# EAGLE design usbisp (EAGLE 5.02)
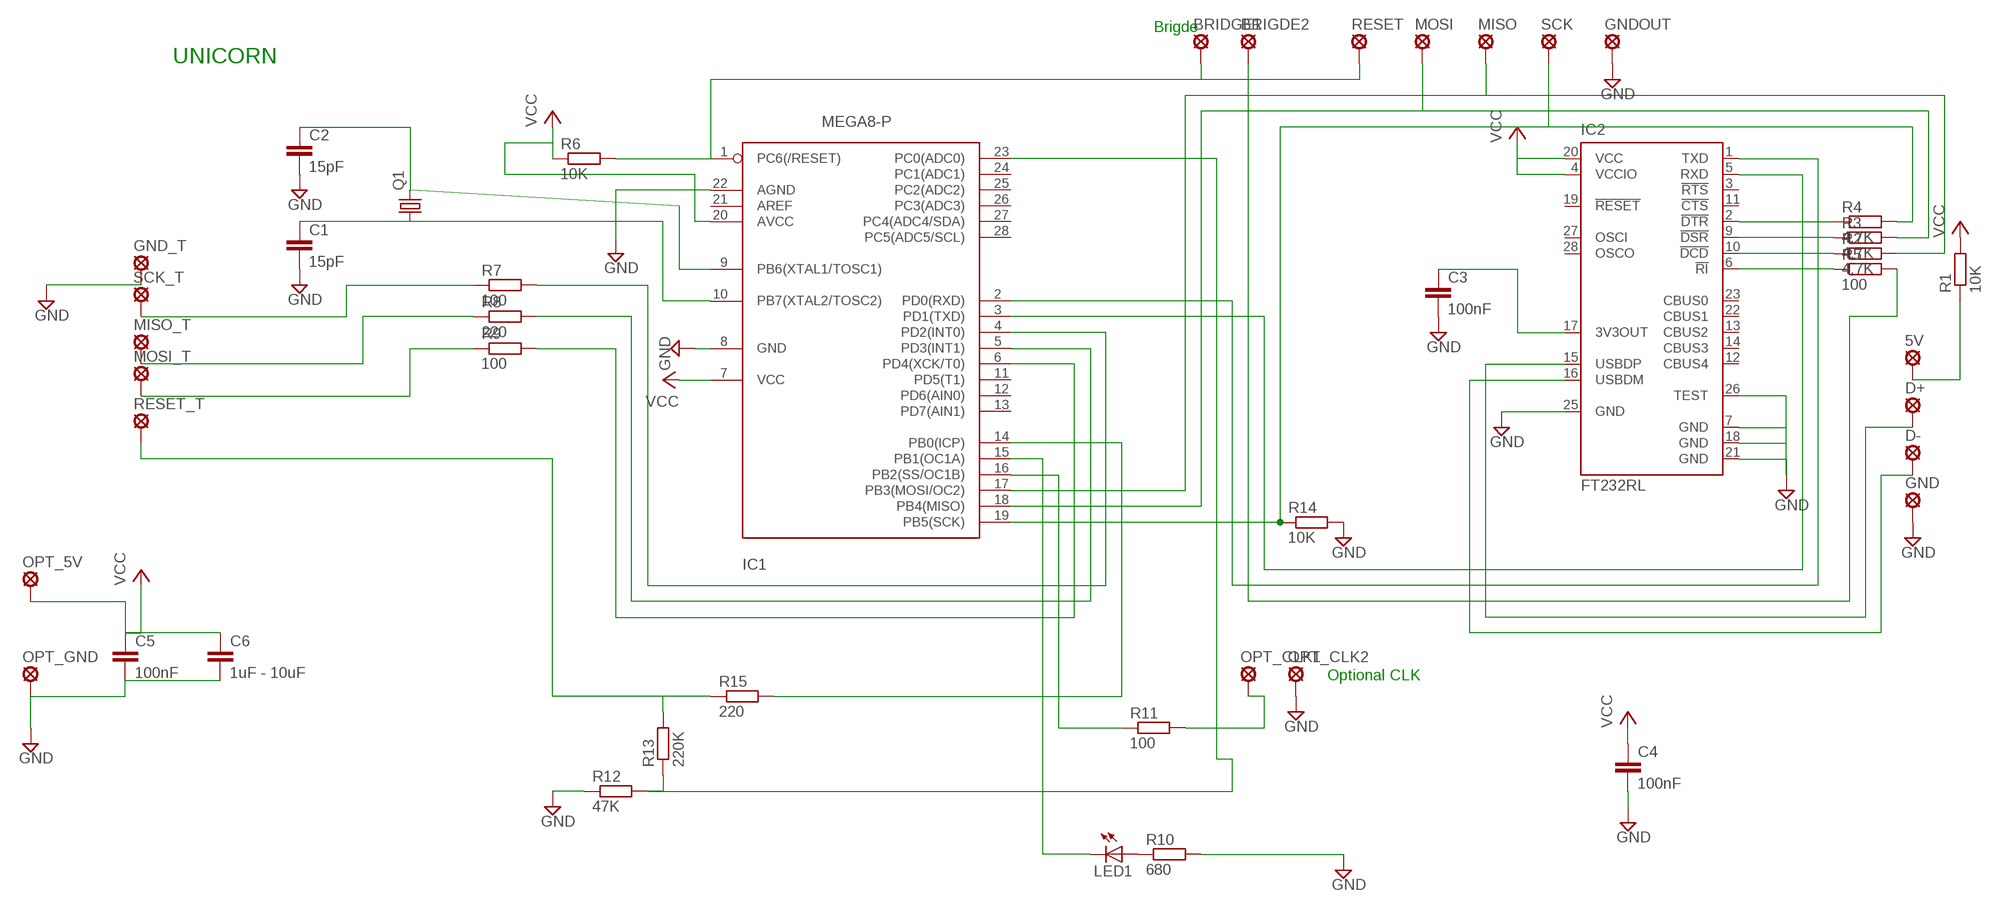
[diagram p0: schematic, sheet 1]

## Parts
5V  LSP10  [LSP10]
BRIDGE1  LSP10  [LSP10]
BRIGDE2  LSP10  [LSP10]
C1  15pF  C-EU075-032X103  [C075-032X103]
C2  15pF  C-EU075-032X103  [C075-032X103]
C3  100nF  C-EU102-043X133  [C102-043X133]
C4  100nF  C-EU102-043X133  [C102-043X133]
C5  100nF  C-EU075-032X103  [C075-032X103]
C6  1uF - 10uF  C-EU075-032X103  [C075-032X103]
D+  LSP10  [LSP10]
D-  LSP10  [LSP10]
GND  LSP10  [LSP10]
GND_T  LSP10  [LSP10]
GNDOUT  LSP10  [LSP10]
IC1  MEGA8-P  [DIL28-3]
IC2  FT232RL  [SSOP28]
LED1  LED5MM  [LED5MM]
MISO  LSP10  [LSP10]
MISO_T  LSP10  [LSP10]
MOSI  LSP10  [LSP10]
MOSI_T  LSP10  [LSP10]
OPT_5V  LSP13  [LSP13]
OPT_CLK1  LSP10  [LSP10]
OPT_CLK2  LSP10  [LSP10]
OPT_GND  LSP13  [LSP13]
Q1  CRYSTALHC49S  [HC49/S]
R1  10K  R-EU_0207/15  [0207/15]
R2  4,7K  R-EU_0207/15  [0207/15]
R3  4,7K  R-EU_0207/15  [0207/15]
R4  4,7K  R-EU_0207/15  [0207/15]
R5  100  R-EU_0207/15  [0207/15]
R6  10K  R-EU_0207/15  [0207/15]
R7  100  R-EU_0207/15  [0207/15]
R8  220  R-EU_0207/15  [0207/15]
R9  100  R-EU_0207/15  [0207/15]
R10  680  R-EU_0207/15  [0207/15]
R11  100  R-EU_0207/15  [0207/15]
R12  47K  R-EU_0207/15  [0207/15]
R13  220K  R-EU_0207/15  [0207/15]
R14  10K  R-EU_0207/15  [0207/15]
R15  220  R-EU_0207/15  [0207/15]
RESET  LSP10  [LSP10]
RESET_T  LSP10  [LSP10]
SCK  LSP10  [LSP10]
SCK_T  LSP10  [LSP10]

## Nets
GND: C1.2 C2.2 C3.2 C4.2 C5.2 C6.2 GND.MP GND_T.MP GNDOUT.MP IC1.8(GND) IC1.22(AGND) IC2.7(GND) IC2.18(GND) IC2.21(GND) IC2.25(GND) IC2.26(TEST) OPT_CLK2.MP OPT_GND.MP R10.2 R12.1 R14.2
N$1: 5V.MP R1.1
N$2: D-.MP IC2.16(USBDM)
N$3: D+.MP IC2.15(USBDP)
N$4: IC1.18(PB4(MISO)) MOSI.MP R3.2
N$5: IC1.17(PB3(MOSI/OC2)) MISO.MP R2.2
N$6: IC2.10(!DCD) R2.1
N$7: IC2.9(!DSR) R3.1
N$8: IC2.2(!DTR) R4.1
N$9: IC1.19(PB5(SCK)) R4.2 R14.1 SCK.MP
N$10: IC1.2(PD0(RXD)) IC2.1(TXD)
N$11: IC2.6(!RI) R5.1
N$12: BRIGDE2.MP R5.2
N$13: IC1.3(PD1(TXD)) IC2.5(RXD)
N$14: BRIDGE1.MP IC1.1(PC6(/RESET)) R6.2 RESET.MP
N$15: IC1.14(PB0(ICP)) R15.2
N$16: R7.1 SCK_T.MP
N$17: IC1.4(PD2(INT0)) R7.2
N$18: IC1.5(PD3(INT1)) R8.2
N$19: MISO_T.MP R8.1
N$20: MOSI_T.MP R9.1
N$21: IC1.6(PD4(XCK/T0)) R9.2
N$22: R13.2 R15.1 RESET_T.MP
N$23: IC1.23(PC0(ADC0)) R12.2 R13.1
N$24: C2.1 IC1.9(PB6(XTAL1/TOSC1)) Q1.2
N$25: C1.1 IC1.10(PB7(XTAL2/TOSC2)) Q1.1
N$26: IC1.16(PB2(SS/OC1B)) R11.1
N$27: OPT_CLK1.MP R11.2
N$28: LED1.A R10.1
N$29: IC1.15(PB1(OC1A)) LED1.K(C)
N$30: C3.1 IC2.17(3V3OUT)
VCC: C4.1 C5.1 C6.1 IC1.7(VCC) IC1.20(AVCC) IC2.4(VCCIO) IC2.20(VCC) OPT_5V.MP R1.2 R6.1
Unconnected: IC1.11(PD5(T1)) IC1.12(PD6(AIN0)) IC1.13(PD7(AIN1)) IC1.21(AREF) IC1.24(PC1(ADC1)) IC1.25(PC2(ADC2)) IC1.26(PC3(ADC3)) IC1.27(PC4(ADC4/SDA)) IC1.28(PC5(ADC5/SCL)) IC2.3(!RTS) IC2.11(!CTS) IC2.12(CBUS4) IC2.13(CBUS2) IC2.14(CBUS3) IC2.19(!RESET) IC2.22(CBUS1) IC2.23(CBUS0) IC2.27(OSCI) IC2.28(OSCO)

## Notes on the sheet
- Brigde
- UNICORN
- Optional CLK

## Library data of the parts
5V BRIDGE1 BRIGDE2 D+ D- GND GND_T GNDOUT MISO MISO_T MOSI MOSI_T OPT_CLK1 OPT_CLK2 RESET RESET_T SCK SCK_T = solpad:LSP10: SOLDER PAD drill 1.0 mm, distributor Buerklin, 12H555
C1-C6 = rcl:C-EU: CAPACITOR, European symbol
IC1 = atmel:MEGA8-P: MICROCONTROLLER 8 Kbytes FLASH, 1 kbytes SRAM, 512 bytes EEPROM, USART, 4-channel 10 bit ADC, 2-channel 8 bit ADC Pin compatible with Atmega48, ATMega88, ATMega168 Source: avr.lbr
IC2 = ftdichip:FT232R: Source: http://www.ftdichip.com/Documents/DataSheets/DS_FT232R_v104.pdf
LED1 = led:LED: LED OSRAM: - CHIPLED LG R971, LG N971, LY N971, LG Q971, LY Q971, LO R971, LY R971 LH N974, LH R974 LS Q976, LO Q976, LY Q976 LO Q996 - Hyper CHIPLED LW Q18S LB Q993, LB Q99A, LB R99A - SideLED LS A670, LO A670, LY A670, LG A670, LP A670 LB A673, LV A673, LT A673, LW A673 LH A674 LY A675 LS A676, LA A676, LO A676, LY A676, LW A676 LS A679, LY A679, LG A679 - Hyper Micro SIDELED® LS Y876, LA Y876, LO Y876, LY Y876 LT Y87S - SmartLED LW L88C, LW L88S LB L89C, LB L89S, LG L890 LS L89K, LO L89K, LY L89K LS L896, LA L896, LO L896, LY L896 - TOPLED LS T670, LO T670, LY T670, LG T670, LP T670 LSG T670, LSP T670, LSY T670, LOP T670, LYG T670 LG T671, LOG T671, LSG T671 LB T673, LV T673, LT T673, LW T673 LH T674 LS T676, LA T676, LO T676, LY T676, LB T676, LH T676, LSB T676, LW T676 LB T67C, LV T67C, LT T67C, LS T67K, LO T67K, LY T67K, LW E67C LS E67B, LA E67B, LO E67B, LY E67B, LB E67C, LV E67C, LT E67C LW T67C LS T679, LY T679, LG T679 LS T770, LO T770, LY T770, LG T770, LP T770 LB T773, LV T773, LT T773, LW T773 LH T774 LS E675, LA E675, LY E675, LS T675 LS T776, LA T776, LO T776, LY T776, LB T776 LHGB T686 LT T68C, LB T68C - Hyper Mini TOPLED® LB M676 - Mini TOPLED Santana® LG M470 LS M47K, LO M47K, LY M47K Source: http://www.osram.convergy.de - LUMILED® LXK2-PW12-R00, LXK2-PW12-S00, LXK2-PW14-U00, LXK2-PW14-V00 LXK2-PM12-R00, LXK2-PM12-S00, LXK2-PM14-U00 LXK2-PE12-Q00, LXK2-PE12-R00, LXK2-PE12-S00, LXK2-PE14-T00, LXK2-PE14-U00 LXK2-PB12-K00, LXK2-PB12-L00, LXK2-PB12-M00, LXK2-PB14-N00, LXK2-PB14-P00, LXK2-PB14-Q00 LXK2-PR12-L00, LXK2-PR12-M00, LXK2-PR14-Q00, LXK2-PR14-R00 LXK2-PD12-Q00, LXK2-PD12-R00, LXK2-PD12-S00 LXK2-PH12-R00, LXK2-PH12-S00 LXK2-PL12-P00, LXK2-PL12-Q00, LXK2-PL12-R00 Source: www.luxeon.com
OPT_5V OPT_GND = solpad:LSP13: SOLDER PAD drill 1.3 mm, distributor Buerklin, 12H562
Q1 = crystal:CRYSTAL: CRYSTAL
R1-R5 = resistor:R-EU_: RESISTOR, European symbol
R6-R15 = rcl:R-EU_: RESISTOR, European symbol

## Board
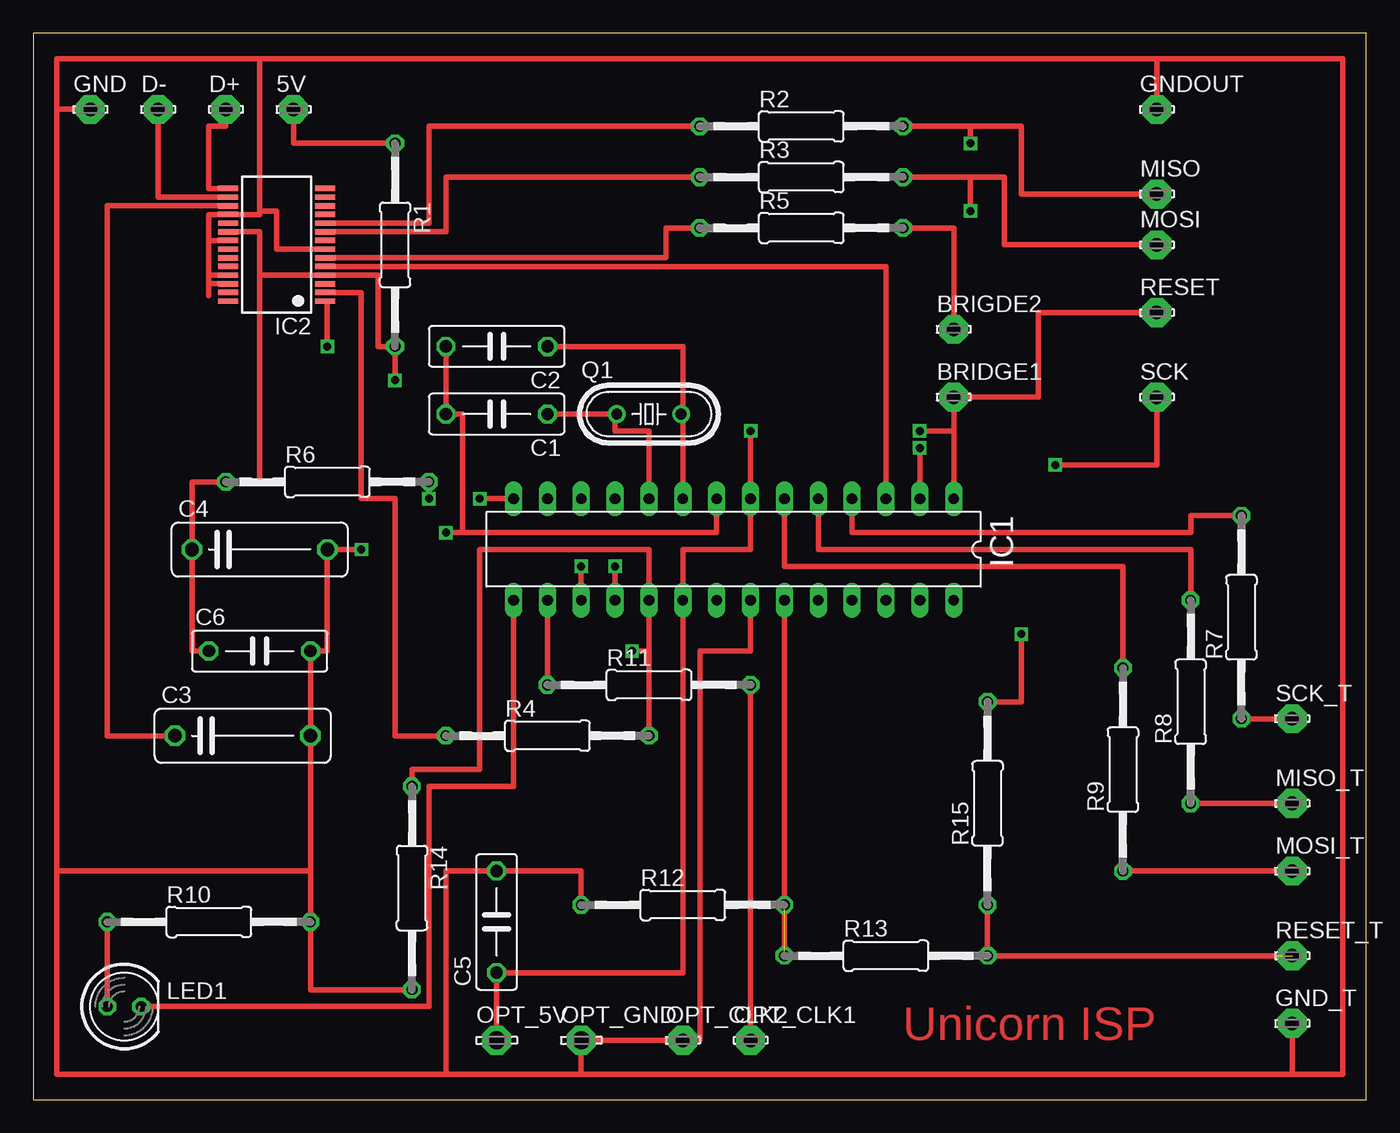
[diagram p1: board, top side]
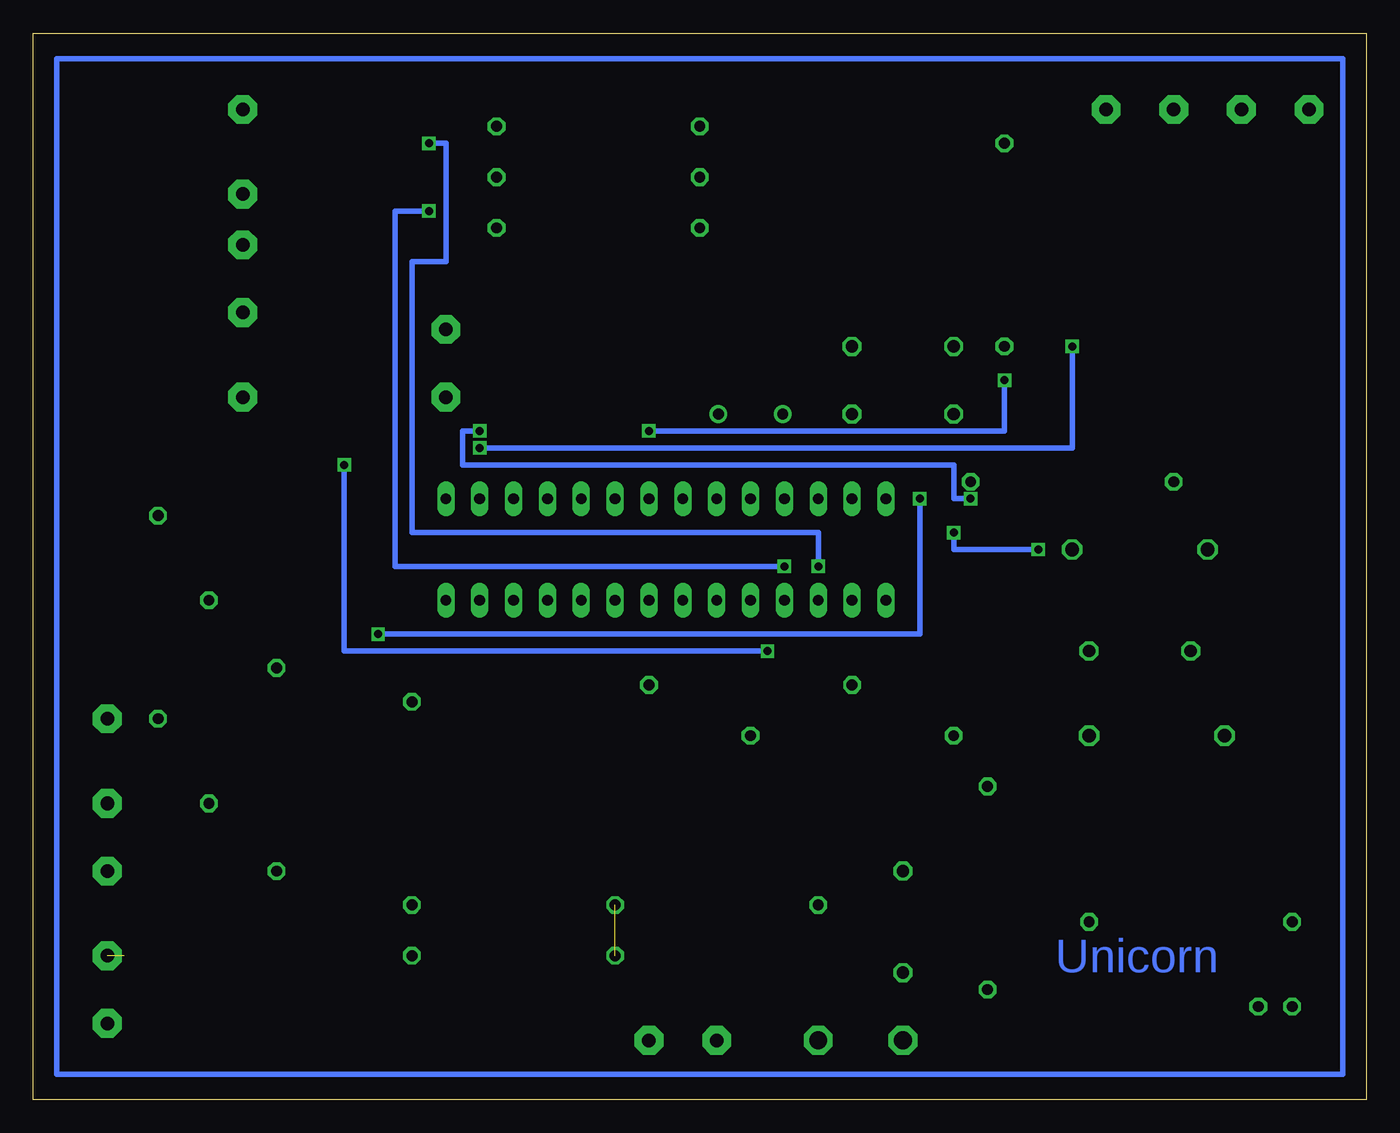
[diagram p2: board, bottom side, seen from below]

Size 100 x 80 mm. Coordinates in mm from the lower left corner, seen from the top.
Outline: 0,0 100,0 100,80 0,80 0,0
Copper layers (1*16): Top 0.035mm / dielectric 1.5mm / Bottom 0.035mm
Design rules "default": minimum track width 10mil, minimum drill 24mil, track to track 8mil, track to pad 8mil, pad to pad 8mil, via to via 8mil, smd to smd 8mil, copper to edge 40mil, drill to drill 8mil, minimum pad ring 10mil, minimum via ring 8mil, stop-mask expansion 4mil, vias tented up to drill 0mil, thermal gap 10mil

### Footprints (pad centres in the part's own frame; a part is rotated, then mirrored left to right if it is on the bottom)
LSP10 = drill 1.016 pad 2.159 octagon: MP 0,0
C075-032X103 = drill 0.914 octagon: 1 -3.81,0; 2 3.81,0
C102-043X133 = drill 1.016 octagon: 1 -5.08,0; 2 5.08,0
DIL28-3 = drill 0.813 long: 1 -16.51,-3.81; 2 -13.97,-3.81; 3 -11.43,-3.81; 4 -8.89,-3.81; 5 -6.35,-3.81; 6 -3.81,-3.81; 7 -1.27,-3.81; 8 1.27,-3.81; 9 3.81,-3.81; 10 6.35,-3.81; 11 8.89,-3.81; 12 11.43,-3.81; 13 13.97,-3.81; 14 16.51,-3.81; 15 16.51,3.81; 16 13.97,3.81; 17 11.43,3.81; 18 8.89,3.81; 19 6.35,3.81; 20 3.81,3.81; 21 1.27,3.81; 22 -1.27,3.81; 23 -3.81,3.81; 24 -6.35,3.81; 25 -8.89,3.81; 26 -11.43,3.81; 27 -13.97,3.81; 28 -16.51,3.81
SSOP28 = smd 0.4 x 1.5: 1 -4.225,-3.625; 2 -3.575,-3.625; 3 -2.925,-3.625; 4 -2.275,-3.625; 5 -1.625,-3.625; 6 -0.975,-3.625; 7 -0.325,-3.625; 8 0.325,-3.625; 9 0.975,-3.625; 10 1.625,-3.625; 11 2.275,-3.625; 12 2.925,-3.625; 13 3.575,-3.625; 14 4.225,-3.625; 15 4.225,3.625; 16 3.575,3.625; 17 2.925,3.625; 18 2.275,3.625; 19 1.625,3.625; 20 0.975,3.625; 21 0.325,3.625; 22 -0.325,3.625; 23 -0.975,3.625; 24 -1.625,3.625; 25 -2.275,3.625; 26 -2.925,3.625; 27 -3.575,3.625; 28 -4.225,3.625
LED5MM = drill 0.813 octagon: A -1.27,0; K 1.27,0
LSP13 = drill 1.321 pad 2.159 octagon: MP 0,0
HC49/S = drill 0.813 round: 1 -2.413,0; 2 2.413,0
0207/15 = drill 0.813 octagon: 1 -7.62,0; 2 7.62,0

### Placement (x,y rotation side)
5V  19.52,74.29 0 top
BRIDGE1  69.05,52.7 0 top
BRIGDE2  69.05,57.78 0 top
C1  34.76,51.43 180 top
C2  34.76,56.51 180 top
C3  15.71,27.3 0 top
C4  16.98,41.27 0 top
C5  34.76,13.33 90 top
C6  16.98,33.65 0 top
D+  14.44,74.29 0 top
D-  9.36,74.29 0 top
GND  4.28,74.29 0 top
GND_T  94.45,5.71 0 top
GNDOUT  84.29,74.29 0 top
IC1  52.54,41.27 180 top
IC2  18.25,64.13 90 top
LED1  6.82,6.98 0 top
MISO  84.29,67.94 0 top
MISO_T  94.45,22.22 0 top
MOSI  84.29,64.13 0 top
MOSI_T  94.45,17.14 0 top
OPT_5V  34.76,4.44 0 top
OPT_CLK1  53.81,4.44 0 top
OPT_CLK2  48.73,4.44 0 top
OPT_GND  41.11,4.44 0 top
Q1  46.19,51.43 0 top
R1  27.14,64.13 270 top
R2  57.62,73.02 0 top
R3  57.62,69.21 0 top
R4  38.57,27.3 0 top
R5  57.62,65.4 0 top
R6  22.06,46.35 0 top
R7  90.64,36.19 90 top
R8  86.83,29.84 90 top
R9  81.75,24.76 90 top
R10  13.17,13.33 0 top
R11  46.19,31.11 0 top
R12  48.73,14.6 0 top
R13  63.97,10.79 0 top
R14  28.41,15.87 270 top
R15  71.59,22.22 90 top
RESET  84.29,59.05 0 top
RESET_T  94.45,10.79 0 top
SCK  84.29,52.7 0 top
SCK_T  94.45,28.57 0 top

### Tracks (layer width: path | path; a pad name or v marks a point on that pad's centre or on a via)
GND  (via drill 0.6)
  Top 0.406: IC1.8 51.27,42.54 32.22,42.54 | 13.17,66.41 IC2.18 | 13.17,61.59 13.17,60.32 | 13.17,64.13 13.17,61.59 | 13.17,66.41 13.17,64.13 | IC2.26 13.17,61.21 13.17,61.59 | IC2.25 13.17,61.86 13.17,61.59 | IC2.21 13.17,64.45 13.17,64.13 | 1.74,74.29 GND.MP | 1.74,74.29 1.74,78.1 16.98,78.1 | 16.98,78.1 84.29,78.1 | 84.29,78.1 98.26,78.1 98.26,1.9 94.45,1.9 | 30.95,1.9 1.74,1.9 1.74,17.14 | 30.95,1.9 41.11,1.9 | 41.11,1.9 94.45,1.9 | 1.74,17.14 1.74,74.29 | 13.17,66.41 16.98,66.41 16.98,66.67 | 16.98,78.1 16.98,66.67 | 94.45,1.9 GND_T.MP | 41.11,1.9 OPT_GND.MP OPT_CLK2.MP 50,4.44 50,33.65 53.81,33.65 IC1.22 | 30.95,1.9 30.95,17.14 C5.2 41.11,17.14 R12.1 | R14.2 20.79,8.25 R10.2 20.79,17.14 | 1.74,17.14 20.79,17.14 | 20.79,17.14 C3.2 C6.2 22.06,33.65 C4.2 v24.6,41.27 | 32.22,42.54 32.22,51.43 C1.2 C2.2 | IC2.7 18.25,63.8 18.25,66.67 16.98,66.67 | v30.95,42.54 32.22,42.54 | 84.29,78.1 GNDOUT.MP
  Bottom 0.406: v24.6,41.27 30.95,41.27 v30.95,42.54
N$1
  Top 0.406: R1.1 19.52,71.75 5V.MP
N$2
  Top 0.406: 9.36,73.02 D-.MP 9.36,67.7 IC2.16
N$3
  Top 0.406: IC2.15 13.17,68.35 13.17,73.02 14.44,73.02 D+.MP
N$4  (via drill 0.6)
  Top 0.406: 70.32,69.21 R3.2 | 70.32,69.21 72.86,69.21 72.86,64.13 MOSI.MP | IC1.18 v43.65,40 | v70.32,66.67 70.32,69.21
  Bottom 0.406: v43.65,40 72.86,40 72.86,66.67 v70.32,66.67
N$5  (via drill 0.6)
  Top 0.406: 70.32,73.02 R2.2 | 70.32,73.02 74.13,73.02 74.13,67.94 MISO.MP | IC1.17 v41.11,40 | v70.32,71.75 70.32,73.02
  Bottom 0.406: v41.11,40 41.11,42.54 71.59,42.54 71.59,62.86 69.05,62.86 69.05,71.75 v70.32,71.75
N$6
  Top 0.406: IC2.10 29.68,65.75 29.68,73.02 R2.1
N$7
  Top 0.406: IC2.9 30.95,65.1 30.95,69.21 R3.1
N$8
  Top 0.406: R4.1 27.14,27.3 27.14,45.08 24.6,45.08 24.6,60.55 IC2.2
N$9  (via drill 0.6)
  Top 0.406: 46.19,33.65 R4.2 | R14.1 28.41,24.76 33.49,24.76 33.49,41.27 46.19,41.27 IC1.19 46.19,33.65 | 46.19,33.65 v44.92,33.65 | v76.67,47.62 84.29,47.62 SCK.MP
  Bottom 0.406: v44.92,33.65 76.67,33.65 v76.67,47.62
N$10  (via drill 0.6)
  Top 0.406: IC2.1 22.06,59.91 v22.06,56.51 | v66.51,48.89 IC1.2
  Bottom 0.406: v66.51,48.89 22.06,48.89 v22.06,56.51
N$11
  Top 0.406: IC2.6 47.46,63.16 47.46,65.4 R5.1
N$12
  Top 0.406: R5.2 69.05,65.4 BRIGDE2.MP
N$13
  Top 0.406: IC2.5 63.97,62.51 IC1.3
N$14  (via drill 0.6)
  Top 0.406: RESET.MP 75.4,59.05 75.4,52.7 BRIDGE1.MP 69.05,50.16 | 69.05,50.16 IC1.1 | v66.51,50.16 69.05,50.16 | v29.68,45.08 R6.2
  Bottom 0.406: v66.51,50.16 67.78,50.16 67.78,47.62 30.95,47.62 30.95,45.08 v29.68,45.08
N$15  (via drill 0.6)
  Top 0.406: R15.2 74.13,29.84 v74.13,34.92 | v33.49,45.08 IC1.14
  Bottom 0.406: v74.13,34.92 33.49,34.92 v33.49,45.08
N$16
  Top 0.406: R7.1 SCK_T.MP
N$17
  Top 0.406: IC1.4 61.43,42.54 86.83,42.54 86.83,43.81 R7.2
N$18
  Top 0.406: R8.2 86.83,41.27 58.89,41.27 IC1.5
N$19
  Top 0.406: R8.1 MISO_T.MP
N$20
  Top 0.406: R9.1 MOSI_T.MP
N$21
  Top 0.406: R9.2 81.75,40 56.35,40 IC1.6
N$22  (1 unrouted)
  Top 0.406: 93.18,10.79 R13.2 R15.1
N$23  (1 unrouted)
  Top 0.406: R13.1 IC1.23
N$24
  Top 0.406: IC1.9 48.73,51.43 | 48.73,51.43 Q1.2 | C2.1 48.73,56.51 48.73,51.43
N$25
  Top 0.406: IC1.10 46.19,50.16 43.65,50.16 43.65,51.43 | 43.65,51.43 Q1.1 | C1.1 43.65,51.43
N$26
  Top 0.406: R11.1 IC1.16
N$27
  Top 0.406: OPT_CLK1.MP R11.2
N$28
  Top 0.406: LED1.A R10.1
N$29
  Top 0.406: LED1.K 29.68,6.98 29.68,23.49 36.03,23.49 IC1.15
N$30
  Top 0.406: IC2.17 5.55,67.05 5.55,27.3 C3.1
N$31
  Bottom 0.406: 98.26,1.9 98.26,78.1 1.74,78.1 1.74,1.9 98.26,1.9
N$32  (via drill 0.6)
  other vias: 76.67,47.62
N$33  (via drill 0.6)
  other vias: 44.92,33.65
N$35  (via drill 0.6)
  other vias: 24.6,41.27
N$36  (via drill 0.6)
  other vias: 30.95,42.54
N$37  (via drill 0.6)
  other vias: 41.11,40
N$38  (via drill 0.6)
  other vias: 43.65,40
N$39  (via drill 0.6)
  other vias: 70.32,66.67
N$40  (via drill 0.6)
  other vias: 70.32,71.75
N$42  (via drill 0.6)
  other vias: 66.51,50.16
N$44  (via drill 0.6)
  other vias: 22.06,56.51
N$45  (via drill 0.6)
  other vias: 27.14,53.97
N$46  (via drill 0.6)
  other vias: 29.68,45.08
VCC  (via drill 0.6)
  Top 0.406: IC2.20 16.98,65.1 16.98,62.86 | 16.98,62.86 16.98,61.86 IC2.4 25.87,61.86 25.87,56.51 R1.2 v27.14,53.97 | OPT_5V.MP C5.1 48.73,9.52 48.73,33.65 IC1.20 48.73,41.27 53.81,41.27 IC1.7 v53.81,50.16 | C6.1 11.9,33.65 C4.1 11.9,46.35 R6.1 16.98,46.35 16.98,62.86
  Bottom 0.406: v53.81,50.16 27.14,50.16 v27.14,53.97

### Text on the board
Top: Unicorn ISP
Bottom: Unicorn